# EAGLE design Open Source Controller Shield (EAGLE 5.11)
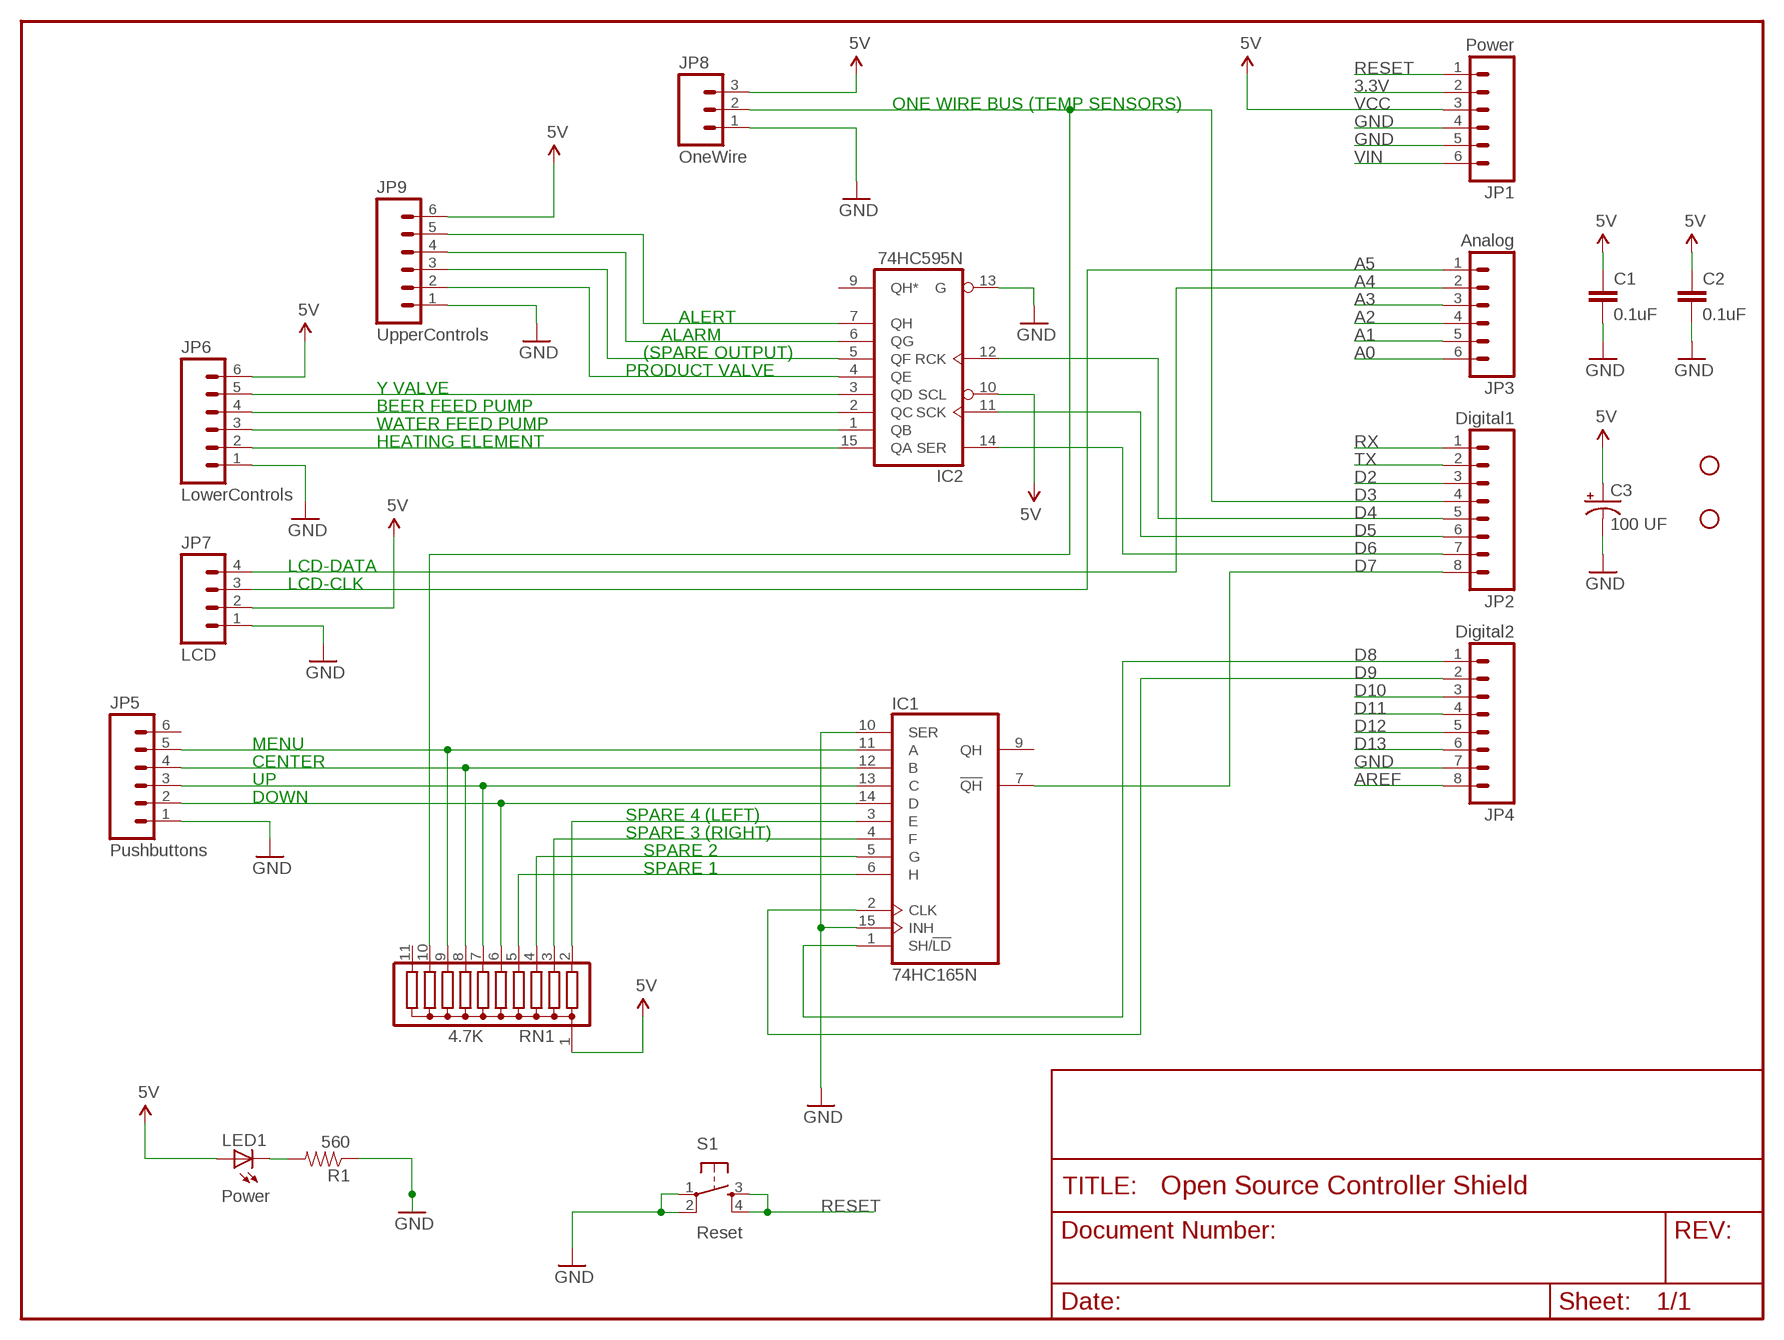
[diagram p0: schematic, sheet 1]

## Parts
C1  0.1uF  CAPPTH2  [CAP-PTH-SMALL2]
C2  0.1uF  CAPPTH2  [CAP-PTH-SMALL2]
C3  100 UF  CAP_POLPTH1  [CPOL-RADIAL-100UF-25V]
IC1  74HC165N  74165N  [DIL16]
IC2  74HC595N  74LS595N  [DIL16]
JP1  Power  M06SIP  [1X06]
JP2  Digital1  M08  [1X08]
JP3  Analog  M06SIP  [1X06]
JP4  Digital2  M08  [1X08]
JP5  Pushbuttons  M06SIP  [1X06]
JP6  LowerControls  M06SIP  [1X06]
JP7  LCD  M04PTH  [1X04]
JP8  OneWire  M03PTH  [1X03]
JP9  UpperControls  M06SIP  [1X06]
JP10  STAND-OFF  [STAND-OFF]
JP11  STAND-OFF  [STAND-OFF]
LED1  Power  LED5MM  [LED5MM]
R1  560  RESISTORPTH1  [AXIAL-0.3]
RN1  4.7K  G10R  [SIL11]
S1  Reset  TAC_SWITCHPTH  [TACTILE-PTH]

## Nets
3.3V: JP1.2
A0: JP3.6
A1: JP3.5
A2: JP3.4
A3: JP3.3
A4: JP3.2 JP7.4
A5: JP3.1 JP7.3
ALARM: IC2.6(QG) JP9.4
ALERT: IC2.7(QH) JP9.5
AREF: JP4.8
CENTER: IC1.12(B) JP5.4 RN1.8
D2: JP2.3
D3: JP2.4 JP8.2 RN1.10
D4: IC2.12(RCK) JP2.5
D5: IC2.11(SCK) JP2.6
D6: IC2.14(SER) JP2.7
D7: IC1.7(!QH) JP2.8
D8: IC1.1(SH/!LD) JP4.1
D9: IC1.2(CLK) JP4.2
D10: JP4.3
D11: JP4.4
D12: JP4.5
D13: JP4.6
DOWN: IC1.14(D) JP5.2 RN1.6
GND [power]: C1.2 C2.2 C3.2(-) IC1.10(SER) IC1.15(INH) IC2.13(G) JP1.4 JP1.5 JP4.7 JP5.1 JP6.1 JP7.1 JP8.1 JP9.1 R1.P$1 S1.1 S1.2
MENU: IC1.11(A) JP5.5 RN1.9
N$1: IC2.2(QC) JP6.4
N$2: IC1.13(C) JP5.3 RN1.7
N$3: IC1.4(F) RN1.3
N$4: IC2.1(QB) JP6.3
N$5: IC2.3(QD) JP6.5
N$6: LED1.K(C) R1.P$2
N$7: IC2.15(QA) JP6.2
PRODUCTVALVE: IC2.4(QE) JP9.2
RESET: JP1.1 S1.3 S1.4
RX: JP2.1
SPARE1: IC1.6(H) RN1.5
SPARE2: IC1.5(G) RN1.4
SPARE4(LEFT): IC1.3(E) RN1.2
SPAREOUTPUT: IC2.5(QF) JP9.3
TX: JP2.2
VCC: C1.1 C2.1 C3.1(+) IC2.10(SCL) JP1.3 JP6.6 JP7.2 JP8.3 JP9.6 LED1.A RN1.1 ; supply symbol labelled 5V
VIN [power]: JP1.6
Unconnected: IC1.9(QH) IC2.9(QH*) JP5.6 RN1.11

## Notes on the sheet
- ONE WIRE BUS (TEMP SENSORS)
- ALERT
- ALARM
- (SPARE OUTPUT)
- PRODUCT VALVE
- Y VALVE
- BEER FEED PUMP
- WATER FEED PUMP
- HEATING ELEMENT
- LCD-DATA
- LCD-CLK
- MENU
- CENTER
- UP
- DOWN
- SPARE 4 (LEFT)
- SPARE 3 (RIGHT)
- SPARE 2
- SPARE 1

## Power pins joined to a net without a drawn wire
GND: IC1.8(GND) IC2.8(GND)
VCC: IC1.16(VCC) IC2.16(VCC)

## Library data of the parts
C1 C2 = SparkFun:CAP: Capacitor Standard 0603 ceramic capacitor, and 0.1" leaded capacitor.
C3 = SparkFun:CAP_POL: Capacitor Polarized These are standard SMD and PTH capacitors. Normally 10uF, 47uF, and 100uF in electrolytic and tantalum varieties. Always verify the external diameter of the through hole cap, it varies with capacity, voltage, and manufacturer. The EIA devices should be standard.
IC1 = 74xx-us:74*165: 8-bit parallel load SHIFT REGISTER
IC2 = 74xx-us:74*595: 8-bit SHIFT REGISTER, output latch
JP1 JP3 JP5 JP6 JP9 = SparkFun:M06: Header 6 Standard 6-pin 0.1" header. Use with straight break away headers (SKU : PRT-00116), right angle break away headers (PRT-00553), swiss pins (PRT-00743), machine pins (PRT-00117), and female headers (PRT-00115). Molex polarized connector foot print use with SKU : PRT-08094 with associated crimp pins and housings. NOTES ON THE VARIANTS LOCK and LOCK_LONGPADS... This footprint was designed to help hold the alignment of a through-hole component (i.e. 6-pin header) while soldering it into place. You may notice that each hole has been shifted either up or down by 0.005 of an inch from it's more standard position (which is a perfectly straight line). This slight alteration caused the pins (the squares in the middle) to touch the edges of the holes. Because they are alternating, it causes a "brace" to hold the component in place. 0.005 has proven to be the perfect amount of "off-center" position when using our standard breakaway headers. Although looks a little odd when you look at the bare footprint, once you have a header in there, the alteration is very hard to notice. Also, if you push a header all the way into place, it is covered up entirely on the bottom side. This idea of altering the position of holes to aid alignment will be further integrated into the Sparkfun Library for other footprints. It can help hold any component with 3 or more connection pins.
JP2 JP4 = SparkFun:M08: Header 8 Standard 8-pin 0.1" header. Use with straight break away headers (SKU : PRT-00116), right angle break away headers (PRT-00553), swiss pins (PRT-00743), machine pins (PRT-00117), and female headers (PRT-00115).
JP7 = SparkFun:M04: Header 4 Standard 4-pin 0.1" header. Use with straight break away headers (SKU : PRT-00116), right angle break away headers (PRT-00553), swiss pins (PRT-00743), machine pins (PRT-00117), and female headers (PRT-00115). Molex polarized connector foot print use with SKU : PRT-08231 with associated crimp pins and housings. 1MM SMD Version SKU: PRT-10208
JP8 = SparkFun:M03: Header 3 Standard 3-pin 0.1" header. Use with straight break away headers (SKU : PRT-00116), right angle break away headers (PRT-00553), swiss pins (PRT-00743), machine pins (PRT-00117), and female headers (PRT-00115). Molex polarized connector foot print use with SKU : PRT-08232 with associated crimp pins and housings.
JP10 JP11 = SparkFun:STAND-OFF: Stand Off This is the mechanical footprint for a #4 phillips button head screw. Use the keepout ring to avoid running the screw head into surrounding components. SKU : PRT-00447
LED1 = SparkFun:LED: LEDs Standard schematic elements and footprints for 5mm, 3mm, 1206, and 0603 sized LEDs. 5mm - Spark Fun Electronics SKU : COM-00529 (and others)
R1 = SparkFun:RESISTOR: Resistor Basic schematic elements and footprints for 0603, 1206, and PTH 1/10th watt (small) resistors.
RN1 = resistor-sil:G10R: SIL RESISTOR; OC_FARNELL: unknown; OC_NEWARK: unknown
S1 = SparkFun:TAC_SWITCH: Momentary Switch Button commonly used for reset or general input. Spark Fun Electronics SKU : COM-00097

## Net classes
1 power: width 0.254 mm

## Board
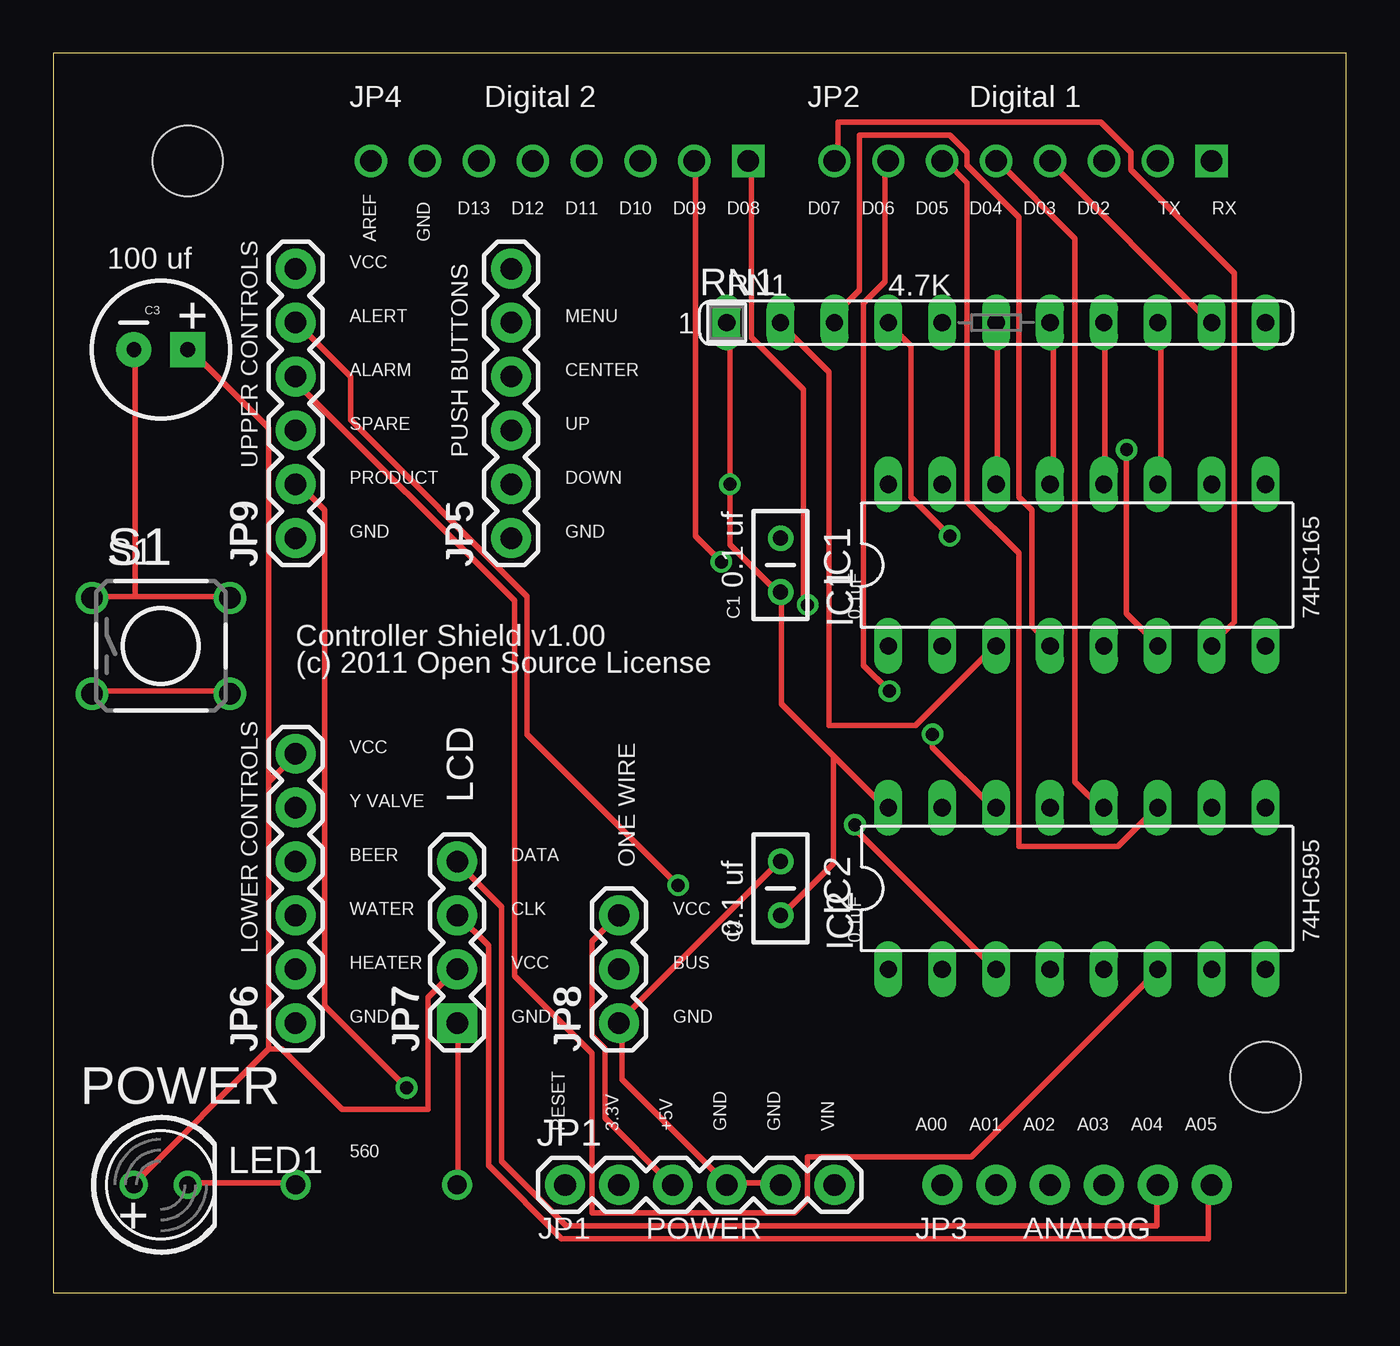
[diagram p1: board, top side]
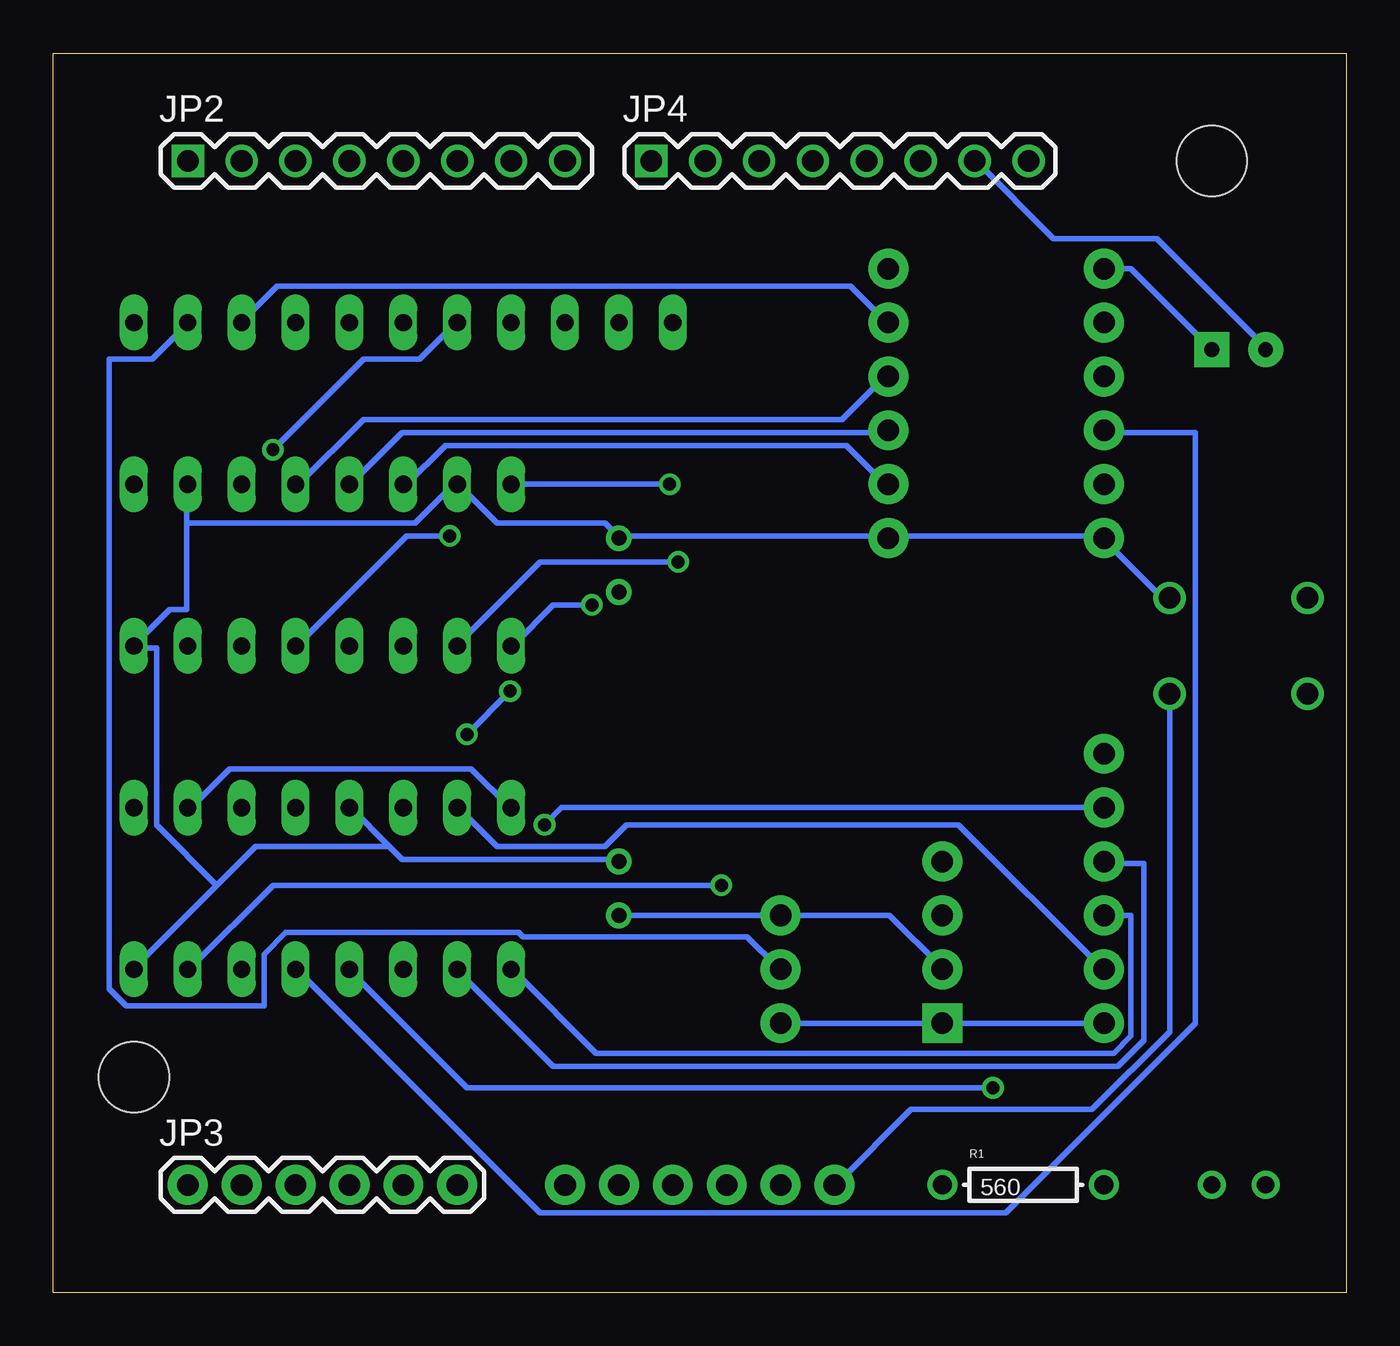
[diagram p2: board, bottom side, seen from below]

Size 60.96 x 58.42 mm. Coordinates in mm from the lower left corner, seen from the top.
Outline: 0,0 60.96,0 60.96,58.42 0,58.42 0,0
Copper layers (1*16): Top 0.035mm / dielectric 1.5mm / Bottom 0.035mm
Design rules "default": minimum track width 10mil, minimum drill 24mil, track to track 8mil, track to pad 8mil, pad to pad 8mil, via to via 8mil, smd to smd 8mil, copper to edge 40mil, drill to drill 8mil, minimum pad ring 10mil, minimum via ring 8mil, stop-mask expansion 4mil, vias tented up to drill 0mil, thermal gap 10mil

### Footprints (pad centres in the part's own frame; a part is rotated, then mirrored left to right if it is on the bottom)
CAP-PTH-SMALL2 = drill 0.7 round: 1 0,0; 2 2.54,0
CPOL-RADIAL-100UF-25V = drill 0.7 pad 1.651 square: 1 1.27,0 | drill 0.7 pad 1.651 round: 2 -1.27,0
DIL16 = drill 0.813 long: 1 -8.89,-3.81; 2 -6.35,-3.81; 3 -3.81,-3.81; 4 -1.27,-3.81; 5 1.27,-3.81; 6 3.81,-3.81; 7 6.35,-3.81; 8 8.89,-3.81; 9 8.89,3.81; 10 6.35,3.81; 11 3.81,3.81; 12 1.27,3.81; 13 -1.27,3.81; 14 -3.81,3.81; 15 -6.35,3.81; 16 -8.89,3.81
1X06 = drill 1.016 pad 1.88 round: 1 0,0; 2 2.54,0; 3 5.08,0; 4 7.62,0; 5 10.16,0; 6 12.7,0
1X08 = drill 1.016 square: 1 0,0 | drill 1.016 round: 2 2.54,0; 3 5.08,0; 4 7.62,0; 5 10.16,0; 6 12.7,0; 7 15.24,0; 8 17.78,0
1X04 = drill 1.016 pad 1.88 square: 1 0,0 | drill 1.016 pad 1.88 round: 2 2.54,0; 3 5.08,0; 4 7.62,0
1X03 = drill 1.016 pad 1.88 round: 1 0,0; 2 2.54,0; 3 5.08,0
STAND-OFF = hole 3.302: 0,0
LED5MM = drill 0.813 round: A -1.27,0; K 1.27,0
AXIAL-0.3 = drill 0.9 round: P$1 -3.81,0; P$2 3.81,0
SIL11 = drill 0.813 long: 1 -12.7,0; 2 -10.16,0; 3 -7.62,0; 4 -5.08,0; 5 -2.54,0; 6 0,0; 7 2.54,0; 8 5.08,0; 9 7.62,0; 10 10.16,0; 11 12.7,0
TACTILE-PTH = drill 1.016 round: 1 -3.251,2.261; 2 3.251,2.261; 3 -3.251,-2.261; 4 3.251,-2.261

### Placement (x,y rotation side)
C1  34.29,33.02 90 top
C2  34.29,17.78 90 top
C3  5.08,44.45 0 top
IC1  48.26,34.29 0 top
IC2  48.26,19.05 0 top
JP1  24.13,5.08 0 top
JP2  54.61,53.34 0 bottom
JP3  54.61,5.08 0 bottom
JP4  32.77,53.34 0 bottom
JP5  21.59,35.56 90 top
JP6  11.43,12.7 90 top
JP7  19.05,12.7 90 top
JP8  26.67,12.7 90 top
JP9  11.43,35.56 90 top
JP10  6.35,53.34 0 top
JP11  57.15,10.16 0 top
LED1  5.08,5.08 0 top
R1  15.24,5.08 0 bottom
RN1  44.45,45.72 0 top
S1  5.08,30.48 0 top

### Tracks (layer width: path | path; a pad name or v marks a point on that pad's centre or on a via)
A4
  Top 0.254: JP7.4 19.1,20.22 21.13,18.19 21.13,6.2 24.18,3.15 52.02,3.15 52.02,4.98 JP3.2
A5
  Top 0.254: JP7.3 19.1,17.78 20.52,16.36 20.52,5.99 23.98,2.54 54.46,2.54 54.46,4.98 JP3.1
ALARM
  Top 0.254: IC2.6 52.02,15.14 43.28,6.4 35.56,6.4 35.56,4.37 34.95,3.76 25.4,3.76 25.4,11.28 21.74,14.93 21.74,32.61 11.58,42.77 11.58,43.18 JP9.4
ALERT  (via drill 0.61)
  Top 0.254: v29.46,19.2 22.35,26.31 22.35,32.82 14.02,41.15 14.02,43.18 11.58,45.62 JP9.5
  Bottom 0.254: v29.46,19.2 50.6,19.2 54.46,15.34 IC2.7
CENTER
  Top 0.254: IC1.12 49.58,38.1 49.58,45.62 RN1.8
  Bottom 0.254: JP5.4 21.74,43.18 23.77,41.15 46.33,41.15 49.38,38.1 IC1.12
D3
  Top 0.254: RN1.10 54.46,45.82 47.14,53.14 47.14,53.34 JP2.4
  Bottom 0.254: JP8.2 26.82,15.34 28.25,16.76 38.81,16.76 39.01,16.97 49.99,16.97 51,15.95 51,13.51 57.51,13.51 58.32,14.33 58.32,43.99 56.29,43.99 54.66,45.62 RN1.10
D4
  Top 0.254: IC2.12 49.38,22.86 48.16,24.08 48.16,49.68 44.5,53.34 JP2.5
D5
  Top 0.254: IC2.11 52.02,22.86 50.19,21.03 45.52,21.03 45.52,34.85 43.08,37.29 43.08,52.32 42.06,53.34 JP2.6
D6  (via drill 0.61)
  Top 0.254: v41.45,26.31 41.45,25.7 44.3,22.86 IC2.14 | v39.42,28.35 38.2,29.57 38.2,46.63 39.22,47.65 39.22,53.34 JP2.7
  Bottom 0.254: v41.45,26.31 v39.42,28.35
D7
  Top 0.254: IC1.7 54.66,30.58 55.68,31.6 55.68,48.06 50.8,52.93 50.8,53.75 49.38,55.17 36.98,55.17 36.98,53.34 JP2.8
D8  (via drill 0.61)
  Top 0.254: v35.56,32.41 35.36,32.61 35.36,42.57 32.92,45.01 32.92,53.34 JP4.1
  Bottom 0.254: v35.56,32.41 37.39,32.41 39.22,30.58 IC1.1
D9  (via drill 0.61)
  Top 0.254: v31.5,34.44 30.28,35.66 30.28,53.34 JP4.2
  Bottom 0.254: v31.5,34.44 38,34.44 41.86,30.58 IC1.2
DOWN
  Top 0.254: IC1.14 44.5,38.1 44.5,45.62 RN1.6
  Bottom 0.254: JP5.2 21.74,38.1 23.57,39.93 42.47,39.93 44.3,38.1 IC1.14
GND
  Top 0.254: R1.P$1 19.1,5.18 19.1,12.7 JP7.1 | JP1.5 34.14,5.18 31.9,5.18 JP1.4 31.7,5.18 26.82,10.06 26.82,12.7 | 26.82,12.7 26.82,12.9 34.14,20.22 C2.2 | JP8.1 26.82,12.7 | 3.86,32.82 8.33,32.82 S1.2 | 3.86,32.82 1.83,32.82 S1.1 | 3.86,32.82 3.86,44.4 C3.2
  Bottom 0.254: JP6.1 JP7.1 JP8.1 | 45.11,21.03 44.5,20.42 34.34,20.42 C2.2 | 45.11,21.03 46.94,22.86 IC2.13 | 53.24,19.2 51.41,21.03 45.11,21.03 | 53.24,19.2 57.1,15.34 IC2.8 | JP4.7 17.48,53.34 13.82,49.68 8.94,49.68 3.86,44.6 C3.2 | 54.66,36.27 54.66,32.21 55.47,32.21 57.1,30.58 IC1.8 57.1,30.38 56.08,30.38 56.08,22.05 53.24,19.2 | 54.66,36.27 54.66,38.1 IC1.10 | S1.2 8.33,32.82 8.74,32.82 11.38,35.46 JP9.1 11.58,35.66 21.54,35.66 JP5.1 21.74,35.66 34.14,35.66 C1.2 34.34,35.66 34.95,36.27 40.03,36.27 41.86,38.1 IC1.15 42.06,38.1 43.89,36.27 54.66,36.27
MENU
  Top 0.254: IC1.11 52.22,38.1 52.22,45.62 RN1.9
  Bottom 0.254: JP5.5 21.74,45.82 23.37,47.45 50.39,47.45 52.02,45.82 RN1.9
N$1
  Bottom 0.254: IC2.2 41.86,15.14 37.39,10.67 10.77,10.67 9.55,11.89 9.55,20.22 11.38,20.22 JP6.4
N$2
  Top 0.254: IC1.13 47.14,38.1 47.14,45.62 RN1.7
  Bottom 0.254: JP5.3 21.74,40.54 44.5,40.54 46.94,38.1 IC1.13
N$3
  Top 0.254: IC1.4 46.94,30.58 46.13,31.39 46.13,36.88 45.52,37.49 45.52,50.7 43.08,53.14 43.08,53.75 42.27,54.56 38,54.56 38,47.24 36.98,46.23 36.98,45.82 RN1.3
N$4
  Bottom 0.254: IC2.1 39.22,15.14 35.36,11.28 10.97,11.28 10.16,12.09 10.16,17.78 JP6.3
N$5  (via drill 0.61)
  Top 0.254: v37.8,22.05 37.8,21.84 44.3,15.34 IC2.3
  Bottom 0.254: v37.8,22.05 36.98,22.86 JP6.5
N$6
  Top 0.254: LED1.K 6.5,5.18 11.38,5.18 R1.P$2
N$7
  Bottom 0.254: IC2.15 41.86,22.86 40.03,21.03 34.95,21.03 33.93,22.05 18.29,22.05 11.58,15.34 JP6.2
PRODUCTVALVE  (via drill 0.61)
  Top 0.254: v16.66,9.65 12.8,13.51 12.8,36.88 11.58,38.1 JP9.2
  Bottom 0.254: v16.66,9.65 41.45,9.65 46.94,15.14 IC2.4
RESET
  Top 0.254: S1.3 1.83,28.35 8.33,28.35 S1.4
  Bottom 0.254: JP1.1 23.98,5.18 20.52,8.64 11.99,8.64 8.33,12.29 S1.4
SPARE1  (via drill 0.61)
  Top 0.254: v50.6,39.73 50.6,32 52.02,30.58 IC1.6
  Bottom 0.254: v50.6,39.73 46.33,43.99 43.69,43.99 42.06,45.62 RN1.5
SPARE2  (via drill 0.61)
  Top 0.254: v42.27,35.66 40.44,37.49 40.44,44.6 39.42,45.62 RN1.4
  Bottom 0.254: v42.27,35.66 44.3,35.66 49.38,30.58 IC1.5
SPARE4(LEFT)
  Top 0.254: IC1.3 44.3,30.38 40.64,26.72 36.58,26.72 36.58,43.38 34.34,45.62 RN1.2
SPAREOUTPUT
  Bottom 0.254: IC2.5 49.38,15.14 38,3.76 16.05,3.76 7.11,12.7 7.11,40.54 11.38,40.54 JP9.3
VCC  (via drill 0.61)
  Top 0.254: 10.16,11.48 3.86,5.18 LED1.A | 10.16,11.48 10.16,24.08 | 10.16,24.08 11.38,25.3 JP6.6 | 10.16,24.08 10.16,40.74 6.5,44.4 C3.1 | JP1.3 29.06,5.18 26.01,8.23 26.01,11.48 25.4,12.09 25.4,16.56 26.62,17.78 JP8.3 | RN1.1 31.9,45.62 v31.9,38.1 31.9,35.26 34.14,33.02 C1.1 34.34,33.02 34.34,27.74 36.78,25.3 | 36.78,25.3 39.22,22.86 IC2.16 | 36.78,25.3 36.78,20.22 34.34,17.78 C2.1 | 10.16,11.48 10.77,11.48 13.61,8.64 17.68,8.64 17.68,13.92 18.9,15.14 JP7.2
  Bottom 0.254: C3.1 10.16,48.26 JP9.6 | C2.1 JP8.3 21.54,17.78 19.1,15.34 JP7.2 | IC2.10 54.46,22.86 52.63,24.69 41.25,24.69 39.42,22.86 IC2.16 | v31.9,38.1 IC1.16

### Text on the board
tPlace: JP4 | Digital 2 | JP2 | Digital 1 | D13 | D12 | D11 | D10 | D09 | D08 | D07 | D06 | D05 | D04 | D03 | D02 | TX | RX | AREF | GND | 100 uf | VCC | RN1 | 4.7K | + | ALERT | MENU | ALARM | CENTER | SPARE | UP | PUSH BUTTONS | UPPER CONTROLS | PRODUCT | DOWN | 0.1 uf | GND | GND | S1 | JP9 | JP5 | IC1 | 74HC165 | Controller Shield v1.00 | (c) 2011 Open Source License | VCC | LCD | Y VALVE | BEER | DATA | ONE WIRE | WATER | CLK | VCC | IC2 | 0.1 uf | 74HC595 | LOWER CONTROLS | HEATER | VCC | BUS | GND | GND | GND | JP6 | JP7 | JP8 | POWER | RESET | 3.3V | +5V | GND | GND | VIN | A00 | A01 | A02 | A03 | A04 | A05 | 560 | + | JP1 | POWER | JP3 | ANALOG